# EAGLE schematic Main Board Schematic 2 v17 (EAGLE 9.7.0)
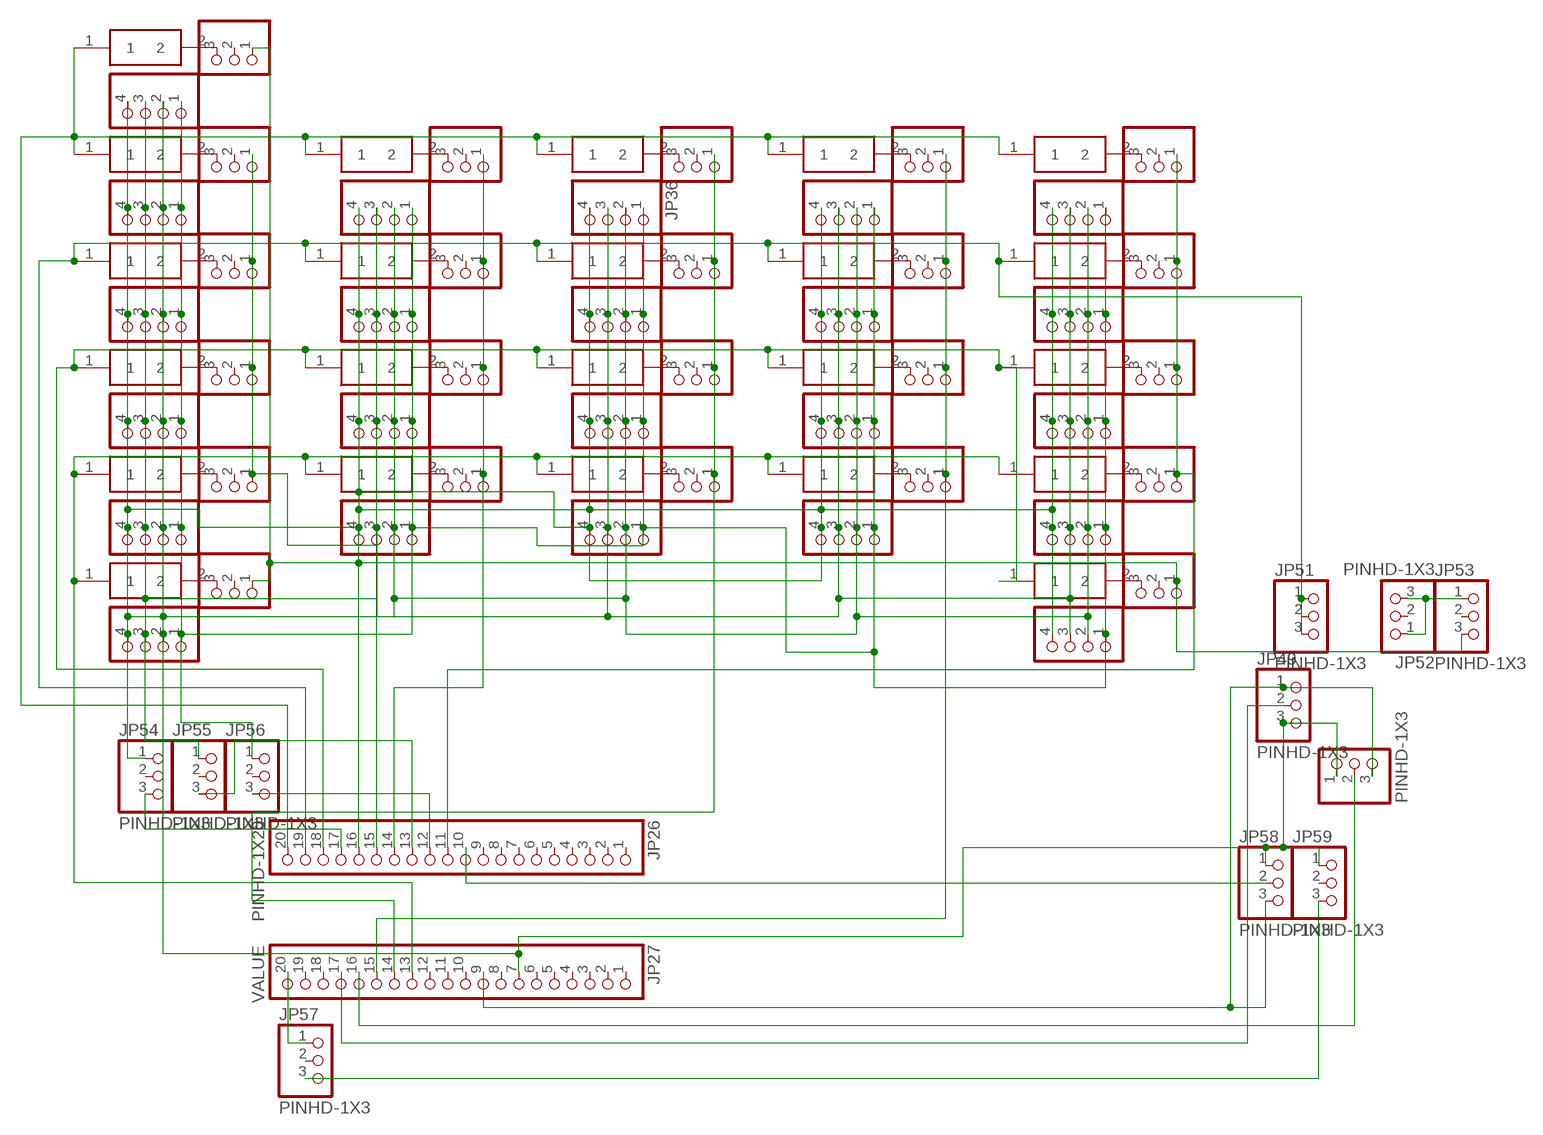
[diagram p0: schematic, sheet 1]

## Parts
1  MX1A-E1NW  [MX1AE1NW]
2  MX1A-E1NW  [MX1AE1NW]
3  MX1A-E1NW  [MX1AE1NW]
4  MX1A-E1NW  [MX1AE1NW]
`  MX1A-E1NW  [MX1AE1NW]
A  MX1A-E1NW  [MX1AE1NW]
C  MX1A-E1NW  [MX1AE1NW]
CAPS  MX1A-E1NW  [MX1AE1NW]
CTRL  MX1A-E1NW  [MX1AE1NW]
D  MX1A-E1NW  [MX1AE1NW]
E  MX1A-E1NW  [MX1AE1NW]
ESC  MX1A-E1NW  [MX1AE1NW]
F  MX1A-E1NW  [MX1AE1NW]
JP1  PINHD-1X3  [1X03]
JP2  PINHD-1X3  [1X03]
JP3  PINHD-1X3  [1X03]
JP4  PINHD-1X3  [1X03]
JP5  PINHD-1X3  [1X03]
JP6  PINHD-1X3  [1X03]
JP7  PINHD-1X3  [1X03]
JP8  PINHD-1X3  [1X03]
JP9  PINHD-1X3  [1X03]
JP10  PINHD-1X3  [1X03]
JP11  PINHD-1X3  [1X03]
JP12  PINHD-1X3  [1X03]
JP13  PINHD-1X3  [1X03]
JP14  PINHD-1X3  [1X03]
JP15  PINHD-1X3  [1X03]
JP16  PINHD-1X3  [1X03]
JP17  PINHD-1X3  [1X03]
JP18  PINHD-1X3  [1X03]
JP19  PINHD-1X3  [1X03]
JP20  PINHD-1X3  [1X03]
JP21  PINHD-1X3  [1X03]
JP22  PINHD-1X3  [1X03]
JP23  PINHD-1X4  [1X04]
JP24  PINHD-1X4  [1X04]
JP25  PINHD-1X3  [1X03]
JP26  PINHD-1X20  [1X20]
JP27  PINHD-1X20  [1X20]
JP28  PINHD-1X4  [1X04]
JP29  PINHD-1X4  [1X04]
JP30  PINHD-1X4  [1X04]
JP31  PINHD-1X4  [1X04]
JP32  PINHD-1X4  [1X04]
JP33  PINHD-1X4  [1X04]
JP34  PINHD-1X4  [1X04]
JP35  PINHD-1X4  [1X04]
JP36  PINHD-1X4  [1X04]
JP37  PINHD-1X4  [1X04]
JP38  PINHD-1X4  [1X04]
JP39  PINHD-1X4  [1X04]
JP40  PINHD-1X4  [1X04]
JP41  PINHD-1X4  [1X04]
JP42  PINHD-1X4  [1X04]
JP43  PINHD-1X4  [1X04]
JP44  PINHD-1X4  [1X04]
JP45  PINHD-1X4  [1X04]
JP46  PINHD-1X4  [1X04]
JP47  PINHD-1X4  [1X04]
JP48  PINHD-1X4  [1X04]
JP49  PINHD-1X3  [1X03]
JP50  PINHD-1X3  [1X03]
JP51  PINHD-1X3  [1X03]
JP52  PINHD-1X3  [1X03]
JP53  PINHD-1X3  [1X03]
JP54  PINHD-1X3  [1X03]
JP55  PINHD-1X3  [1X03]
JP56  PINHD-1X3  [1X03]
JP57  PINHD-1X3  [1X03]
JP58  PINHD-1X3  [1X03]
JP59  PINHD-1X3  [1X03]
Q  MX1A-E1NW  [MX1AE1NW]
R  MX1A-E1NW  [MX1AE1NW]
S  MX1A-E1NW  [MX1AE1NW]
SHIFT  MX1A-E1NW  [MX1AE1NW]
SPACE  MX1A-E1NW  [MX1AE1NW]
TAB  MX1A-E1NW  [MX1AE1NW]
V  MX1A-E1NW  [MX1AE1NW]
W  MX1A-E1NW  [MX1AE1NW]
X  MX1A-E1NW  [MX1AE1NW]
Z  MX1A-E1NW  [MX1AE1NW]

## Nets
N$1: `.2 JP1.3
N$2: JP2.3 TAB.2
N$3: CAPS.2 JP3.3
N$4: JP4.3 SHIFT.2
N$5: 1.2 JP5.3
N$6: JP6.3 Q.2
N$7: A.2 JP7.3
N$8: JP8.3 Z.2
N$9: 2.2 JP9.3
N$10: JP10.3 W.2
N$11: JP11.3 S.2
N$12: JP12.3 X.2
N$13: 3.2 JP13.3
N$14: E.2 JP14.3
N$15: D.2 JP15.3
N$16: C.2 JP16.3
N$17: 4.2 JP17.3
N$18: JP18.3 R.2
N$19: F.2 JP19.3
N$20: JP20.3 V.2
N$21: CTRL.2 JP21.3
N$22: JP22.3 SPACE.2
N$23: C.1 CTRL.1 JP27.13 SHIFT.1 V.1 X.1 Z.1
N$24: A.1 CAPS.1 D.1 F.1 JP26.18 S.1 SPACE.1
N$25: ESC.2 JP25.3
N$26: E.1 JP26.19 JP51.1 JP51.2 JP51.3 Q.1 R.1 TAB.1 W.1
N$27: 1.1 2.1 3.1 4.1 `.1 ESC.1 JP26.20
N$28: JP23.2 JP24.2 JP27.7 JP28.2 JP29.2 JP30.2 JP31.2 JP32.2 JP33.2 JP34.2 JP35.2 JP36.2 JP37.2 JP38.2 JP39.2 JP40.2 JP41.2 JP42.2 JP43.2 JP44.2 JP45.2 JP46.2 JP47.2 JP48.2 JP49.3 JP50.1 JP58.1 JP59.1
N$29: JP1.1 JP2.1 JP3.1 JP4.1 JP26.15
N$30: JP9.1 JP10.1 JP11.1 JP12.1 JP27.14
N$31: JP13.1 JP14.1 JP15.1 JP16.1 JP27.15
N$32: JP17.1 JP18.1 JP19.1 JP20.1 JP26.11
N$33: JP21.1 JP22.1 JP25.1 JP26.16 JP53.3
N$34: JP52.1 JP52.3 JP53.1
N$37: JP23.4 JP24.4 JP28.4 JP29.4 JP30.4 JP31.4 JP32.4 JP33.4 JP34.4 JP35.4 JP36.4 JP37.4 JP38.4 JP39.4 JP40.4 JP41.4 JP42.4 JP43.4 JP44.4 JP45.4 JP46.4 JP47.4 JP48.4 JP54.1
N$38: JP26.17 JP54.3
N$40: JP26.13 JP55.3
N$41: JP5.1 JP6.1 JP7.1 JP8.1 JP26.14
N$42: JP26.12 JP56.3
N$43: JP23.3 JP24.3 JP28.3 JP29.3 JP30.3 JP31.3 JP32.3 JP33.3 JP34.3 JP35.3 JP36.3 JP37.3 JP38.3 JP39.3 JP40.3 JP41.3 JP42.3 JP43.3 JP44.3 JP45.3 JP46.3 JP47.3 JP48.3 JP55.1
N$44: JP23.1 JP24.1 JP28.1 JP29.1 JP30.1 JP31.1 JP32.1 JP33.1 JP34.1 JP35.1 JP36.1 JP37.1 JP38.1 JP39.1 JP40.1 JP41.1 JP42.1 JP43.1 JP44.1 JP45.1 JP46.1 JP47.1 JP48.1 JP56.1
N$58: JP27.20 JP57.1
N$59: JP57.3 JP59.3
N$61: JP26.10 JP58.2
N$62: JP27.16 JP50.2
N$63: JP27.17 JP49.2
N$65: JP27.9 JP49.1 JP50.3 JP58.3
Unconnected: JP1.2 JP2.2 JP3.2 JP4.2 JP5.2 JP6.2 JP7.2 JP8.2 JP9.2 JP10.2 JP11.2 JP12.2 JP13.2 JP14.2 JP15.2 JP16.2 JP17.2 JP18.2 JP19.2 JP20.2 JP21.2 JP22.2 JP25.2 JP26.1 JP26.2 JP26.3 JP26.4 JP26.5 JP26.6 JP26.7 JP26.8 JP26.9 JP27.1 JP27.2 JP27.3 JP27.4 JP27.5 JP27.6 JP27.8 JP27.10 JP27.11 JP27.12 JP27.18 JP27.19 JP52.2 JP53.2 JP54.2 JP55.2 JP56.2 JP57.2 JP59.2

## Library data of the parts
1-4 ` A C CAPS CTRL D E ESC F Q R S SHIFT SPACE TAB V W X Z = SamacSys_Parts:MX1A-E1NW: Pushbutton Switches Full Travel, Mech. Keyswitch, Click Tactile Feel (Blue stem), 60cN, No LED, No Diode, Fixation Pins for PCB Mounting Source: Datasheet <https://media.digikey.com/pdf/Data Sheets/Cherry PDFs/MX Series.pdf>; DESCRIPTION: Pushbutton Switches Full Travel, Mech. Keyswitch, Click Tactile Feel (Blue stem), 60cN, No LED, No Diode, Fixation Pins for PCB Mounting; HEIGHT: 15.2mm; MANUFACTURER_NAME: Cherry; MANUFACTURER_PART_NUMBER: MX1A-E1NW; MOUSER_PART_NUMBER: 540-MX1A-E1NW; MOUSER_PRICE-STOCK: https://www.mouser.co.uk/ProductDetail/CHERRY/MX1A-E1NW/?qs=Z7NFYKyvgJd45Wm4xzFv7w%3D%3D
JP1-JP22 JP25 JP49-JP59 = Connector:PINHD-1X3: PIN HEADER; CATEGORY: CONNECTOR; SUB-CATEGORY: PIN-HEADER
JP23 JP24 JP28-JP48 = Connector:PINHD-1X4: PIN HEADER; CATEGORY: CONNECTOR; SUB-CATEGORY: PIN-HEADER
JP26 JP27 = Connector:PINHD-1X20: PIN HEADER; CATEGORY: CONNECTOR; SUB-CATEGORY: PIN-HEADER